# Altium schematic sheet 01_NRF52.SchDoc: Wearable Ultra Low-Power Ultrasound probe
size A3; DrawnBy: Sebastian Frey; Organization: Integrated Systems Laboratory; Revision: v1.2; SheetNumber: 2; SheetTotal: 6
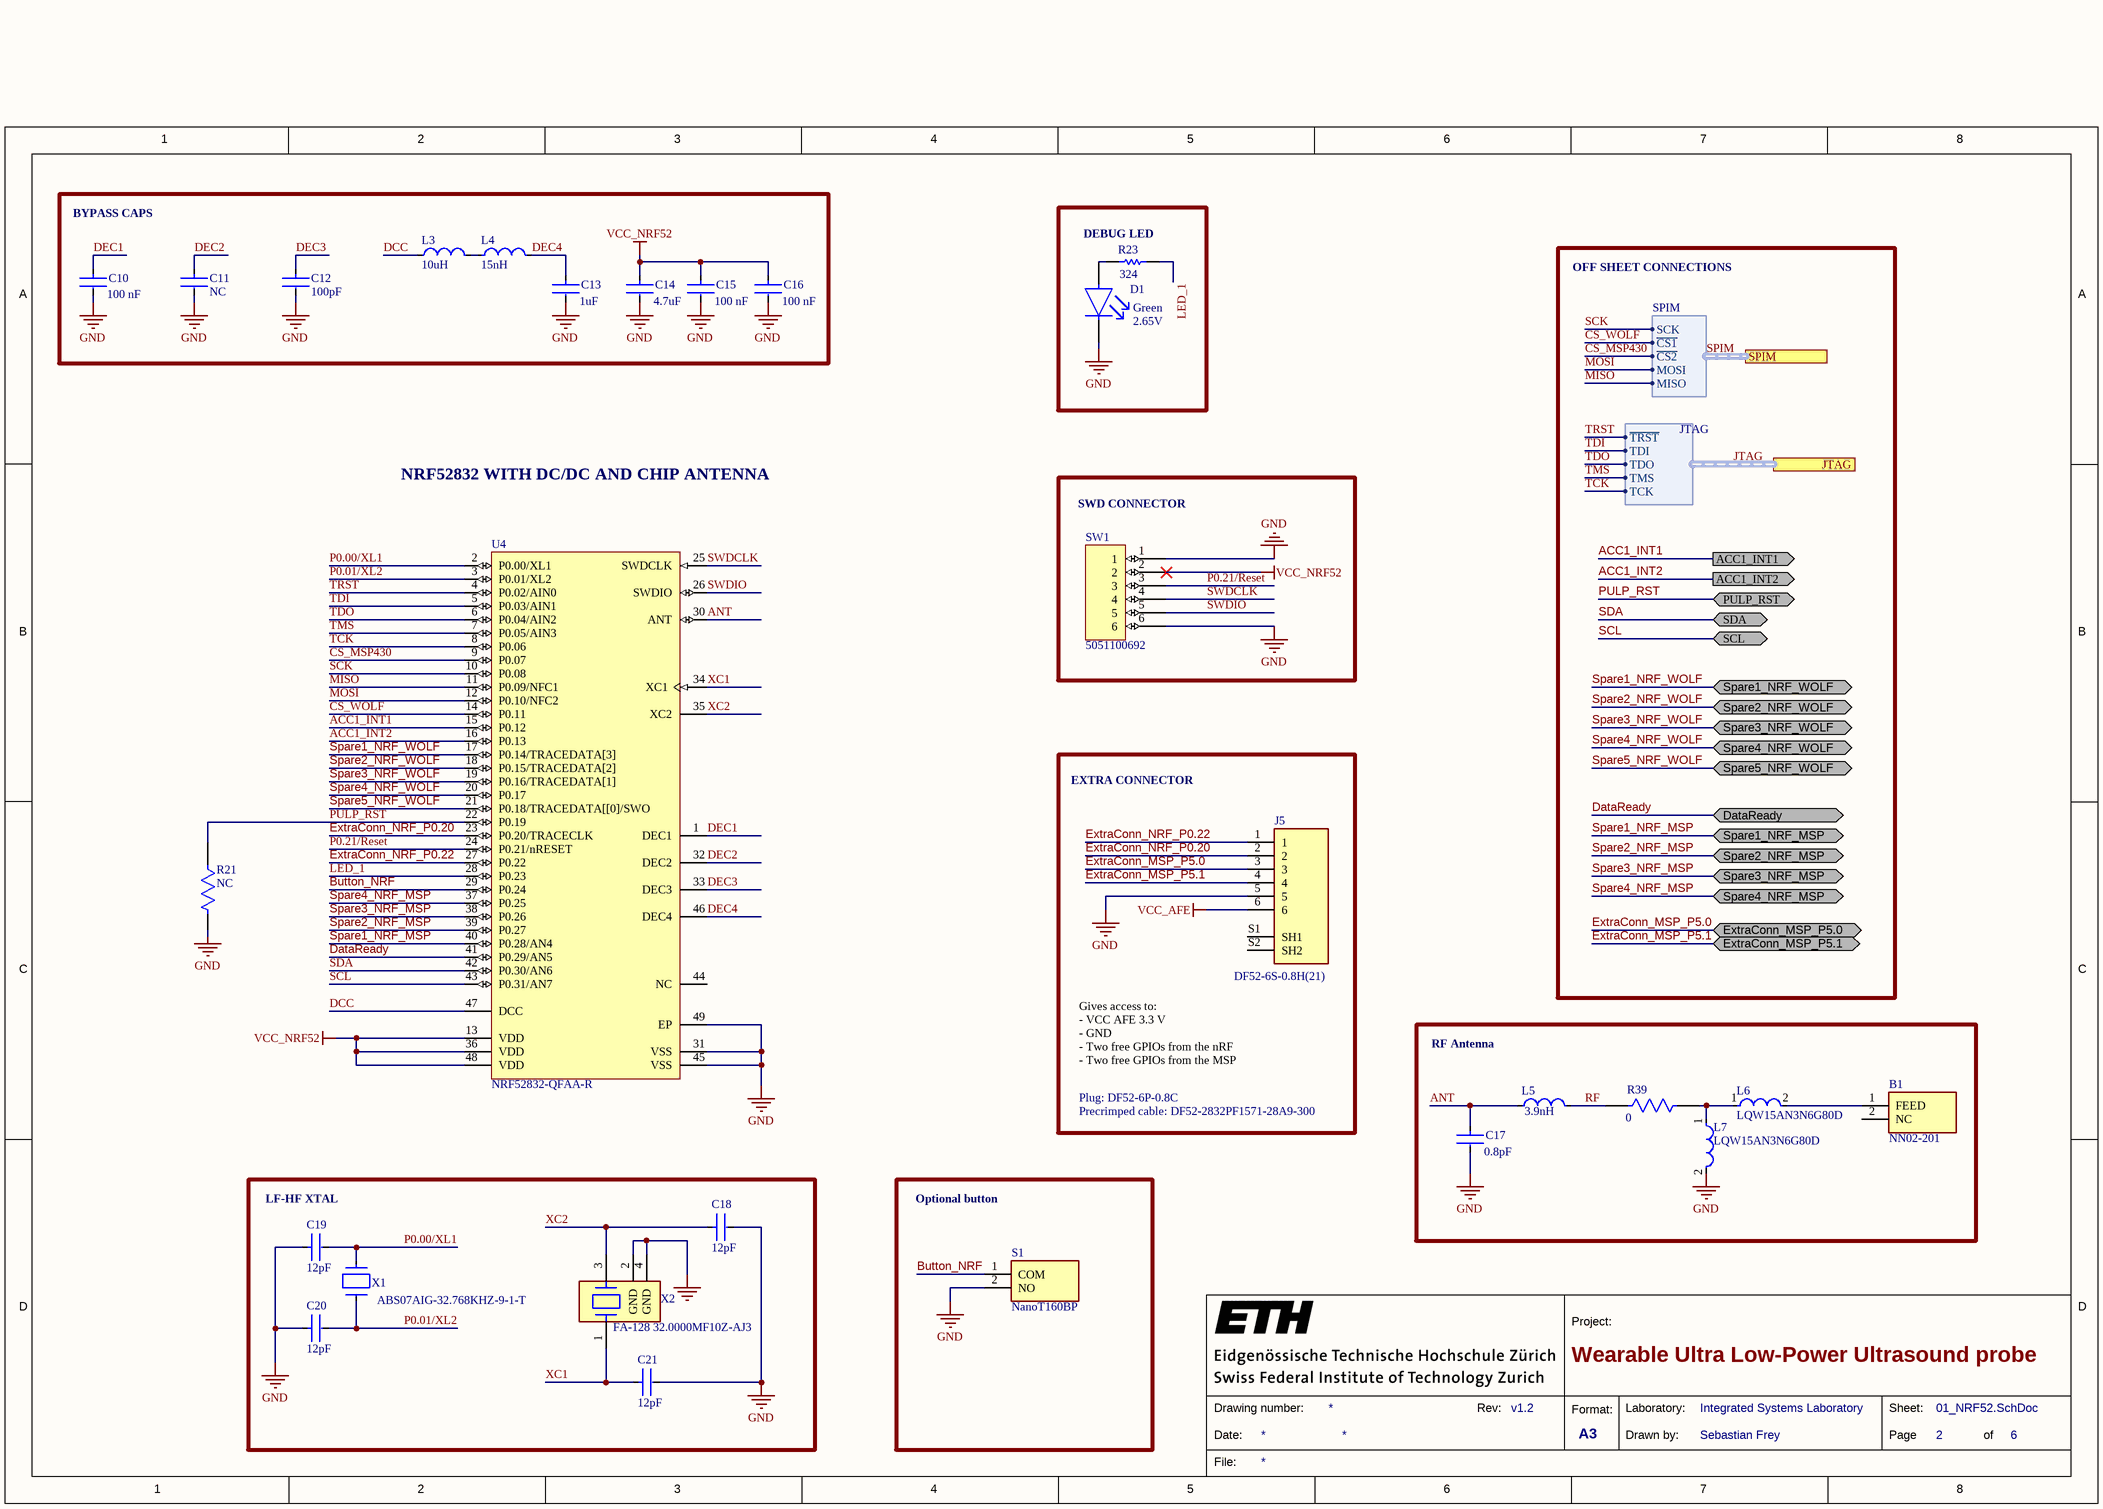
[diagram p0: 01_NRF52.SchDoc]

## Parts
B1  NN02-201  [NN02201]
C10  value 100 nF  [FP-CC0402-MFG]  (hidden comment: CC0402KRX7R7BB104)
C11  Capacitance: NC  [FP-04025A101JAT2A-MFG]  (hidden comment: not mounted)
C12  Capacitance: 100pF  [FP-04025A101JAT2A-MFG]  (hidden comment: 04025A101JAT2A)
C13  Capacitance: 1uF  [FP-C1608-080-0_1-IPC_B]  (hidden comment: C1608X7R1C105K080AC)
C14  Capacitance: 4.7uF  [FP-0603-L_1_6_0_15-W_0_8-IPC_A]  (hidden comment: EMK107ABJ475KA-T)
C15  value 100 nF  [FP-CC0402-MFG]  (hidden comment: CC0402KRX7R7BB104)
C16  value 100 nF  [FP-CC0402-MFG]  (hidden comment: CC0402KRX7R7BB104)
C17  Capacitance: 0.8pF  [FP-GJM155-0_05-IPC_A]  (hidden comment: GJM1555C1HR80WB01D)
C18  Capacitance: 12pF  [FP-GJM155-0_05-IPC_A]  (hidden comment: GJM1555C1H120GB01D)
C19  Capacitance: 12pF  [FP-GJM155-0_05-IPC_A]  (hidden comment: GJM1555C1H120GB01D)
C20  Capacitance: 12pF  [FP-GJM155-0_05-IPC_A]  (hidden comment: GJM1555C1H120GB01D)
C21  Capacitance: 12pF  [FP-GJM155-0_05-IPC_A]  (hidden comment: GJM1555C1H120GB01D)
D1  Forward Voltage: 2.65V  Color: Green  [FP-APHD1608LZGCK-MFG]  (hidden comment: APHD1608LZGCK)
J5  DF52-6S-0.8H(21)  [HIROSE_DF52-6S-0.8H(21)]
L3  Inductance: 10uH  [L0603B100KDWFT]  (hidden comment: L0603B100KDWFT)
L4  Inductance: 15nH  [FP-LQW15AN_00-W0_6-0_1-MFG]  (hidden comment: LQW15AN15NJ00D)
L5  Inductance: 3.9nH  [INDC1005X45N]  (hidden comment: LQG15HS3N9B02D)
L6  LQW15AN3N6G80D  [Component_0402_0603]
L7  LQW15AN3N6G80D  [Component_0402_0603]
R21  Resistance: NC  [FP-ERJ2RK-IPC_C]
R23  Resistance: 324  [RESC1005X35X20ML05T10]  (hidden comment: CPF0402B324RE1)
R39  Resistance: 0  [Component_0402_0603]  (hidden comment: CR0402-J/-000GLF)
S1  NanoT160BP  [NanoT160BP]
SW1  5051100692  [MOLEX_5051100692]
U4  NRF52832-QFAA-R  [NRSC-QF-48_M]
X1  ABS07AIG-32.768KHZ-9-1-T  [Crys_Abracon_ABS07AIG-32_768KHZ-9-1-T_eec_MFG]
X2  FA-128 32.0000MF10Z-AJ3  [Crys_Seiko_Epson_Corporation_FA-128_32.0000MF10Z-AJ3_eec_0]

## Blocks framed on the sheet
BYPASS CAPS: C10-C16 L3 L4
DEBUG LED: D1 R23
SWD CONNECTOR: SW1
RF Antenna: B1 C17 L5-L7 R39
LF-HF XTAL: C18-C21 X1 X2
Optional button: S1

## Ports
ACC1_INT1 (out), ACC1_INT2 (out), DataReady (bidir), ExtraConn_MSP_P5.0 (bidir), ExtraConn_MSP_P5.1 (bidir), JTAG (harness JTAG), PULP_RST (bidir), SCL (bidir), SDA (bidir), Spare1_NRF_MSP (bidir), Spare1_NRF_WOLF (bidir), Spare2_NRF_MSP (bidir), Spare2_NRF_WOLF (bidir), Spare3_NRF_MSP (bidir), Spare3_NRF_WOLF (bidir), Spare4_NRF_MSP (bidir), Spare4_NRF_WOLF (bidir), Spare5_NRF_WOLF (bidir), SPIM (harness SPIM)

## Harnesses
SPIM: SCK, ~{CS1}, ~{CS2}, MOSI, MISO
JTAG: ~{TRST}, TCK, TMS, TDI, TDO

## Nets
GND: C10.2 C11.1 C12.1 C13.1 C14.2 C15.2 C16.2 C17.2 C18.2 C19.1 C20.1 C21.2 D1.1(C) J5.5 L7.2 R21.2 S1.2(NO) SW1.1 SW1.6 U4.31(VSS) U4.45(VSS) U4.49(EP) X2.2(GND) X2.4(GND)
VCC_AFE: J5.6
VCC_NRF52: C14.1 C15.1 C16.1 SW1.2 U4.13(VDD) U4.36(VDD) U4.48(VDD)
ACC1_INT1: U4.15(P0.12) ; port ACC1_INT1
ACC1_INT2: U4.16(P0.13) ; port ACC1_INT2
ANT: C17.1 L5.1 U4.30(ANT)
Button_NRF: S1.1(COM) U4.29(P0.24)
CS_MSP430: U4.9(P0.07) ; port SPIM.~{CS2}
CS_WOLF: U4.14(P0.11) ; port SPIM.~{CS1}
DataReady: U4.41(P0.29/AN5) ; port DataReady
DCC: L3.1 U4.47(DCC)
DEC1: C10.1 U4.1(DEC1)
DEC2: C11.2 U4.32(DEC2)
DEC3: C12.2 U4.33(DEC3)
DEC4: C13.2 L4.2 U4.46(DEC4)
ExtraConn_MSP_P5.0: J5.3 ; port ExtraConn_MSP_P5.0
ExtraConn_MSP_P5.1: J5.4 ; port ExtraConn_MSP_P5.1
ExtraConn_NRF_P0.20: J5.2 U4.23(P0.20/TRACECLK)
ExtraConn_NRF_P0.22: J5.1 U4.27(P0.22)
LED_1: R23.1 U4.28(P0.23)
MISO: U4.11(P0.09/NFC1) ; port SPIM.MISO
MOSI: U4.12(P0.10/NFC2) ; port SPIM.MOSI
P0.00/XL1: C19.2 U4.2(P0.00/XL1) X1.1
P0.01/XL2: C20.2 U4.3(P0.01/XL2) X1.2
P0.21/Reset: SW1.3 U4.24(P0.21/nRESET)
PULP_RST: R21.1 U4.22(P0.19) ; port PULP_RST
RF: L5.2 R39.1
SCK: U4.10(P0.08) ; port SPIM.SCK
SCL: U4.43(P0.31/AN7) ; port SCL
SDA: U4.42(P0.30/AN6) ; port SDA
Spare1_NRF_MSP: U4.40(P0.28/AN4) ; port Spare1_NRF_MSP
Spare1_NRF_WOLF: U4.17(P0.14/TRACEDATA[3]) ; port Spare1_NRF_WOLF
Spare2_NRF_MSP: U4.39(P0.27) ; port Spare2_NRF_MSP
Spare2_NRF_WOLF: U4.18(P0.15/TRACEDATA[2]) ; port Spare2_NRF_WOLF
Spare3_NRF_MSP: U4.38(P0.26) ; port Spare3_NRF_MSP
Spare3_NRF_WOLF: U4.19(P0.16/TRACEDATA[1]) ; port Spare3_NRF_WOLF
Spare4_NRF_MSP: U4.37(P0.25) ; port Spare4_NRF_MSP
Spare4_NRF_WOLF: U4.20(P0.17) ; port Spare4_NRF_WOLF
Spare5_NRF_WOLF: U4.21(P0.18/TRACEDATA[[0]/SWO) ; port Spare5_NRF_WOLF
SWDCLK: SW1.4 U4.25(SWDCLK)
SWDIO: SW1.5 U4.26(SWDIO)
TCK: U4.8(P0.06) ; port JTAG.TCK  [project net JTAG.TCK]
TDI: U4.5(P0.03/AIN1) ; port JTAG.TDI  [project net JTAG.TDI]
TDO: U4.6(P0.04/AIN2) ; port JTAG.TDO  [project net JTAG.TDO]
TMS: U4.7(P0.05/AIN3) ; port JTAG.TMS  [project net JTAG.TMS]
TRST: U4.4(P0.02/AIN0) ; port JTAG.~{TRST}  [project net JTAG.~{TRST}]
XC1: C21.1 U4.34(XC1) X2.1
XC2: C18.1 U4.35(XC2) X2.3
NetB1_1: B1.1(FEED) L6.2
NetD1_2: D1.2(A) R23.2
NetL3_2: L3.2 L4.1
NetL6_1: L6.1 L7.1 R39.2

Not connected (* = marked no-connect by the designer): B1 2(NC); J5 S1(SH1) S2(SH2); U4 44(NC)

## Buses and harness runs
harness JTAG = port JTAG
harness SPIM = port SPIM

## Notes on the sheet
- OFF SHEET CONNECTIONS
- NRF52832 WITH DC/DC AND CHIP ANTENNA
- EXTRA CONNECTOR
- Plug: DF52-6P-0.8C
- Precrimped cable: DF52-2832PF1571-28A9-300
- (near J5) Gives access to:
  - VCC AFE 3.3 V
  - GND
  - Two free GPIOs from the nRF
  - Two free GPIOs from the MSP
- 1
- 2
- 3
- 4
- 5
- 6
- 7
- 8
- A
- B
- C
- D
- Project:
- Date:
- Drawing number:
- Rev:
- Format:
- A3
- Drawn by:
- Laboratory:
- Page
- Sheet:
- of
- File:

## Library data of the parts
B1 = NN02-201: RF ANTENNA 2G, 3G, 4G, 5G, DCS, GSM, LTE, PCS, UMTS, Wifi DB Chip SMA Surface Mount; Manufacturer_Name: Ignion; Geometry.Height: 1mm; Mouser Part Number: 128-NN02-201; Mouser Price/Stock: https://www.mouser.co.uk/ProductDetail/Ignion/NN02-201?qs=OlC7AqGiEDkwQ5K6vk7DOw%3D%3D; Manufacturer_Part_Number: NN02-201; Datasheet Link: https://ignion.io/files/UM_NN02-201.pdf
C10 C15 C16 = CMP-03422-000048-1: CAP CER 0.1UF 16V X7R 0402; Manufacturer: YAGEO; Material: Ceramic; Automotive Grade: NA; Temperature Coefficient: 30ppm/°C; Tolerance: 0.1; Device Class L1: Passive Components; Temperature Range Low: -55°C; Device Class L3: Ceramic Capacitors; Temperature Characteristic: X7R; Ipc Land Pattern Name: CAPC10050X50; Capacitance: 100 nF; Temperature Range High: +125°C; Voltage Rating: 16 V; Temperature: -55°C to +125°C; RoHS: TRUE; Automotive: No; Height: 0.55mm; Device Class L2: Capacitors; Digikey Description: CAP CER 0.1UF 16V X7R 0402; Package: CC0402; Footprint Url: http://www.yageo.com/exep/pages/download/literatures/UPY-C_GEN_24.pdf; ComponentLink2Description: Datasheet; Category: Cap; Lead Free: Yes; Octopart: https://octopart.com/cc0402krx7r7bb104-yageo-42244624; ComponentLink2URL: http://www.yageo.com/documents/recent/UPY-GP_NP0_16V-to-50V_16.pdf; Manufacturer Part Number: CC0402KRX7R7BB104; Mouser Description: 0402 0.1 uF 16 V ±10 % Tolerance X7R SMT Multilayer Ceramic Capacitor
C11 = CMP-2008-02568-2: Tolerance: 5%; Voltage: 50V; Insulation Resistance: 1GR; Dielectric: C0G; Dissipation Factor: 2.5%; Temperature Coefficient: 30ppm/°C; Depth: 0.5mm; Max Operating Temperature: 125°C; Contact Plating: Tin; Width: 0.02inch; Radiation Hardening: No; Case/Package: 0402; Voltage Rating: 50V; Packaging: Tape and Reel; Termination: SMD/SMT; REACH SVHC: No SVHC; Case Code (Metric): 1005; Mount: Surface Mount; Package Quantity: 1; Height: 0.56mm; Construction: Flat; Case Code (Imperial): 0402; RoHS Compliant: Yes; Voltage Rating (DC): 50V; Thickness: 0.022inch; Series: -; Min Operating Temperature: -55°C; Lead Free: Lead Free; Length: 1mm
C12 = CMP-2008-02568-2: CAP CER 100PF 50V C0G/NP0 0402; Tolerance: 5%; Insulation Resistance: 1GR; Dielectric: C0G; Dissipation Factor: 2.5%; Temperature Coefficient: 30ppm/°C; Depth: 0.5mm; Max Operating Temperature: 125°C; Voltage: 50V; Contact Plating: Tin; Width: 0.02inch; Radiation Hardening: No; Case/Package: 0402; Voltage Rating: 50V; Packaging: Tape and Reel; Termination: SMD/SMT; REACH SVHC: No SVHC; Case Code (Metric): 1005; Mount: Surface Mount; Package Quantity: 1; Height: 0.56mm; Construction: Flat; Case Code (Imperial): 0402; RoHS Compliant: Yes; Voltage Rating (DC): 50V; Thickness: 0.022inch; Series: -; Min Operating Temperature: -55°C; Lead Free: Lead Free; Length: 1mm
C13 = CMP-08246-002727-1: Multilayer Ceramic Capacitors 1μF ±10% 16V X7R SMD 0603; Mount: Surface Mount; Width: 0.031inch; Radiation Hardening: No; Dielectric Material: Ceramic; Packaging: Tape and Reel; Voltage Rating: 16V; Weight: 7.1E-05oz; Termination: SMD/SMT; Package Quantity: 1; Voltage Rating (DC): 16V; REACH SVHC: No SVHC; Voltage: 16V; Min Operating Temperature: -55°C; Depth: 0.8mm; Height: 0.8mm; Length: 1.6mm; Case Code (Metric): 1608; Thickness: 0.037inch; Lead Free: Lead Free; Resistor Type: Ceramic; RoHS Compliant: Yes; Series: C; Construction: Flat; Max Operating Temperature: 125°C; Tolerance: 10%; Case/Package: 0603; Dielectric: X7R; Case Code (Imperial): 0603
C14 = CMP-2000-06225-3: None; Voltage Rating (DC): 16V; Tolerance: 10%; Dielectric: X5R; Case/Package: 0603; Length: 1.6mm; Case Code (Imperial): 0603; Resistor Type: Ceramic; Packaging: Tape and Reel; Min Operating Temperature: -55°C; Series: M; Construction: Flat; Termination: SMD/SMT; Max Operating Temperature: 85°C; Voltage Rating: 16V; Width: 0.8mm; Case Code (Metric): 1608; Number of Pins: 2; RoHS Compliant: Yes; REACH SVHC: No SVHC; Package Quantity: 1; Thickness: 0.035inch; Height: 0.8mm; Mount: Surface Mount
C17 = CMP-2008-03761-2: Multi-Layer Ceramic Capacitor 0.8pF C0G  ±0.05pF 0402 Paper T/R; Voltage Rating: 50V; Height: 0.5mm; Package Quantity: 10000; Min Operating Temperature: -55°C; Dielectric: C0G; Max Operating Temperature: 125°C; Case Code (Metric): 1005; Thickness: 0.022inch; Width: 0.02inch; Radiation Hardening: No; Packaging: Tape and Reel; Case Code (Imperial): 0402; Case/Package: 0402; Mount: Surface Mount; Voltage Rating (DC): 50V; Termination: SMD/SMT; Depth: 0.5mm; Length: 1mm
C18-C21 = CMP-2008-03799-2: Multi-Layer Ceramic Capacitor 12pF C0G  ±2% 0402 Paper T/R; Voltage Rating: 50V; Tolerance: 2%; Length: 1mm; Width: 0.5mm; Thickness: 0.022inch; Package Quantity: 10000; Lead Free: Lead Free; Mount: Surface Mount; Voltage Rating (DC): 50V; Max Operating Temperature: 125°C; Termination: SMD/SMT; Depth: 0.5mm; Min Operating Temperature: -55°C; Height: 0.5mm; Case Code (Imperial): 0402; Case/Package: 0402; Case Code (Metric): 1005; Dielectric: C0G; Packaging: Tape and Reel; Radiation Hardening: No
D1 = CMP-44529-000045-1: LED GREEN CLEAR 1608 SMD; Test Current: 2mA; Dominant Wavelength: 525nm; Lens Color: Colorless; Luminous Intensity: 180mcd; Viewing Angle: 100°; Lens Size: 0.7mm; Lens Style: Round; Mount: Surface Mount; Packaging: Tape and Reel; Lens Transparency: Clear; Height: 0.75mm; Case/Package: 0603; Length: 1.6mm; Case Code (Metric): 1608; Width: 0.8mm; Case Code (Imperial): 0603
J5 = DF52-6S-0.8H(21): 6 Position Socket Connector Surface Mount, Right Angle; MP: DF52-6S-0.8H_21_; MF: Hirose; Availability: Unavailable; SnapEDA_Link: https://www.snapeda.com/parts/DF52-6S-0.8H%2821%29/Hirose%20Electric%20Co%20Ltd/view-part/624923/?ref=snap; Value: *; Price: None; Package: None
L3 = L0603B100KDWFT: Inductor RF Chip Wirewound 10uH 10% 2.52MHz 0.38A 0.36Ohm DCR 0603 T/R; Manufacturer: KEMET; Self Resonant Frequency: 32MHz; Shielding: Shielded; Max DC Current: 115mA; DC Resistance (DCR): 360mR; DC Current: 380mA; Supplier 1: Farnell; Manufacturer Part Number: L0603B100KDWFT; RoHS: Yes; Category: Fixed Inductors; Stock 1: 1725; Pricing 1: 5=0.45200, 50=0.25500, 250=0.24300, 500=0.20900, 1500=0.18400, 3000=0.15700, 15000=0.13700 (CHF); Case/Package: 0603; Min Operating Temperature: -25°C; Max Operating Temperature: 105°C; Tolerance: 10%; Packaging: Tape and Reel; Package Quantity: 3000; Termination: SMD/SMT; Test Frequency: 2.52MHz; Resistor Type: Ceramic; Series: L-DWF; Length: 1.6mm; Width: 0.8mm; Height: 0.8mm; Depth: 1mm; Military Standard: Not; RoHS Compliant: Yes; ComponentLink1URL: http://www.mouser.com/ds/2/212/F3115-1104303.pdf?src-supplier=Mouser; ComponentLink1Description: http://www.mouser.com/ds/2/212/F3115-1104303.pdf?src-supplier=Mouser; ComponentLink2URL: http://components.arrow.com/part/dataview/0323_00380344?src-supplier=Arrow+Europe; ComponentLink2Description: http://components.arrow.com/part/dataview/0323_00380344?src-supplier=Arrow+Europe; Supplier Part Number 1: 3638979
L4 = CMP-2000-06595-2: Wire Wound RF Inductor 15nH ±5% 460mA 0.16Ω 0402 (1005); Test Frequency: 100MHz; DC Resistance (DCR): 160mR; Shielding: Unshielded; Q Factor: 30; Core Material: Air; Self Resonant Frequency: 5GHz; Resistor Type: Wirewound; DC Current: 460mA; Weight: 2.8E-05oz; Radiation Hardening: No; Depth: 0.7mm; Package Quantity: 10000; Case/Package: 0402; Packaging: Tape and Reel; Length: 1mm; Max DC Current: 460mA; Case Code (Imperial): 0402; Tolerance: 5%; Min Operating Temperature: -55°C; Lead Free: Lead Free; Width: 0.02inch; Case Code (Metric): 1005; Termination: SMD/SMT; Military Standard: Not; Current Rating: 460mA; Height: 0.5mm; Mount: Surface Mount; Max Operating Temperature: 125°C
L5 = LQP15MN3N9B02D: Inductor RF Chip Thin Film 3.9nH 0.1nH 500MHz 13Q-Factor 170mA 500mOhm DCR 0402 Paper T/R; Manufacturer: Murata; Core Material: Non-Magnetic; DC Resistance (DCR): 500mR; Q Factor: 13; Self Resonant Frequency: 6GHz; Shielding: Unshielded; Supplier 1: Digi-Key; Manufacturer Part Number: LQP15MN3N9B02D; RoHS: Yes; Category: Fixed Inductors; Stock 1: 22125; Pricing 1: 1=0.18000, 10=0.15800, 25=0.14040, 50=0.11920, 100=0.10520, 250=0.09644, 500=0.08768, 1000=0.07365, 2500=0.06313 (USD); Mount: Surface Mount; Case/Package: 0402; Case Code (Metric): 1005; Case Code (Imperial): 0402; Min Operating Temperature: -40°C; Max Operating Temperature: 85°C; Max DC Current: 170mA; Packaging: Tape and Reel; Package Quantity: 10000; Current Rating: 170mA; Termination: SMD/SMT; Resistor Type: Thin Film; Test Frequency: 500MHz; DC Current: 170mA; Series: LQP15M; Rated Current-Max: 170mA; Technology: THIN FILM; Length: 1.1mm; Width: 0.5mm; Height: 0.35mm; Depth: 0.6mm; Height - Seated (Max): 0.018inch; Radiation Hardening: No; Military Standard: Not; Lead Free: Lead Free; RoHS Compliant: Yes; ComponentLink1URL: https://datasheet.ciiva.com/27054/1865137-27054329.pdf?src-supplier=Jameco; ComponentLink1Description: https://datasheet.ciiva.com/27054/1865137-27054329.pdf?src-supplier=Jameco; ComponentLink2URL: https://datasheet.ciiva.com/11799/0900766b80f155d9-11799807.pdf?src-supplier=RSComponents; ComponentLink2Description: https://datasheet.ciiva.com/11799/0900766b80f155d9-11799807.pdf?src-supplier=RSComponents; ComponentLink3URL: https://datasheet.ciiva.com/8510/l0075s0084lqp15m-8510329.pdf?src-supplier=Avnet; ComponentLink3Description: https://datasheet.ciiva.com/8510/l0075s0084lqp15m-8510329.pdf?src-supplier=Avnet; ComponentLink4URL: https://datasheet.ciiva.com/4976/product-4976732.pdf?src-supplier=Mouser; ComponentLink4Description: https://datasheet.ciiva.com/4976/product-4976732.pdf?src-supplier=Mouser; ComponentLink5URL: https://datasheet.ciiva.com/1039/l0075s0084lqp15m-1039837.pdf?src-supplier=Digi-Key; ComponentLink5Description: https://datasheet.ciiva.com/1039/l0075s0084lqp15m-1039837.pdf?src-supplier=Digi-Key; ComponentLink6URL: https://datasheet.ciiva.com/1039/l0075s0084lqp15m-1039838.pdf?src-supplier=Digi-Key; ComponentLink6Description: https://datasheet.ciiva.com/1039/l0075s0084lqp15m-1039838.pdf?src-supplier=Digi-Key; ComponentLink7URL: https://datasheet.ciiva.com/1039/l0075s0084lqp15m-1039839.pdf?src-supplier=Digi-Key; ComponentLink7Description: https://datasheet.ciiva.com/1039/l0075s0084lqp15m-1039839.pdf?src-supplier=Digi-Key; ComponentLink8URL: https://datasheet.ciiva.com/16362/l0075s0084lqp15m-16362181.pdf?src-supplier=Future+Electronics; ComponentLink8Description: https://datasheet.ciiva.com/16362/l0075s0084lqp15m-16362181.pdf?src-supplier=Future+Electronics; ComponentLink9URL: https://datasheet.ciiva.com/18230/getdatasheetpartid-153200-18230711.pdf?src-supplier=Verical; ComponentLink9Description: https://datasheet.ciiva.com/18230/getdatasheetpartid-153200-18230711.pdf?src-supplier=Verical; ComponentLink10URL: https://datasheet.ciiva.com/8510/l0075s0084lqp15m-8510975.pdf?src-supplier=Avnet; ComponentLink10Description: https://datasheet.ciiva.com/8510/l0075s0084lqp15m-8510975.pdf?src-supplier=Avnet; Supplier Part Number 1: 490-1131-1-ND
L6 L7 = 725321dda6339637d4d059423bc1c3c: Wire Wound RF Inductor 3.6nH ±2% 1950mA 0.03Ω 0402 (1005)
R21 = CMP-2002-00608-4: not mounted; Voltage Rating (DC): 50V; Tolerance: 1%; Power Rating: 100mW; Temperature Coefficient: 100ppm/°C; Case/Package: 0402; Length: 1mm; Package Quantity: 1; Radiation Hardening: No; Case Code (Metric): 1005; Contact Plating: Tin; Mount: Surface Mount; Depth: 0.5mm; Max Operating Temperature: 155°C; Lead Free: Lead Free; Width: 0.5mm; Composition: Thick Film; Case Code (Imperial): 0402; Termination: SMD/SMT; Number of Pins: 2; Height: 0.35mm; Voltage Rating: 50V; Military Standard: Not; REACH SVHC: No SVHC; Packaging: Tape and Reel; Min Operating Temperature: -55°C; Max Power Dissipation: 100mW; Features: Automotive AEC-Q200; Number of Terminations: 2
R23 = CMP-2002-03257-1: Manufacturer: TE Connectivity / AMP; Part Number: CPF0402B324RE1
R39 = 1029c3af85768c4190bb7ad29bc67b5: Thick Film Chip Resistors 0402 0Ω 0.0625W 5%; Voltage Rating (DC): 50V; Max Power Dissipation: 63mW; Temperature Coefficient: 500ppm/°C; Power Rating: 62.5mW; Depth: 0.5mm; Packaging: Tape and Reel; REACH SVHC: No SVHC; Max Operating Temperature: 125°C; Case Code (Metric): 1005; Case Code (Imperial): 0402; Case/Package: 0402; Number of Pins: 2; Thickness: 356um; Composition: Thick Film; Voltage Rating: 50V; Min Operating Temperature: -55°C; Tolerance: 5%; Radiation Hardening: No; Height: 0.35mm; Termination: SMD/SMT; Width: 0.5mm; Mount: Surface Mount; Package Quantity: 10000; Contact Plating: Tin; Length: 1mm
S1 = NanoT160BP: Switch; Manufacturer_Name: LITTELFUSE; Datasheet Link: https://www.ckswitches.com/media/2866/nanot.pdf; Height: 1mm; Manufacturer_Part_Number: NanoT160BP
SW1 = MOLEX_5051100692
U4 = CMP-2100-03661-1: Multiprotocol Bluetooth Smart, ANT/ANT+ and Proprietary System-on-Chip, 2.4 GHz, 256 KB FLASH, 1.7 to 3.6 V, -40 to 85 degC, 48-Pin QFN, RoHS, Tape and Reel; Manufacturer: Nordic Semiconductor; Frequency: 2.4GHz; Datasheet Version: Rev. 1.0, 02/2016; Datasheet URL: http://infocenter.nordicsemi.com/pdf/nRF52832_PS_v1.0.pdf; Mount: SurfaceMount; Max Operating Temperature: 85degC; Manufacturer URL: http://www.nordicsemi.com/eng/Products/; Lead Free: LeadFree; Min Operating Temperature: -40degC; RoHSCompliant: true; Package Reference: QF-48; Package Description: 48-Pin Quad Flat No-lead Package, Body 6 x 6 mm, Pitch 0.4 mm, Thermal Pad 4.6 x 4.6 mm; Max Frequency: 2.4GHz; Packaging: TapeandReel
X1 = Crys_Abracon_ABS07AIG-32_768KHZ-9-1-T_eec: Crystal; Part Nr: ABS07AIG-32.768KHZ-9-1-T
X2 = Crys_Seiko_Epson_Corporation_FA-128_32.0000MF10Z-AJ3_eec: Crystal; Part Nr: FA-128 32.0000MF10Z-AJ3